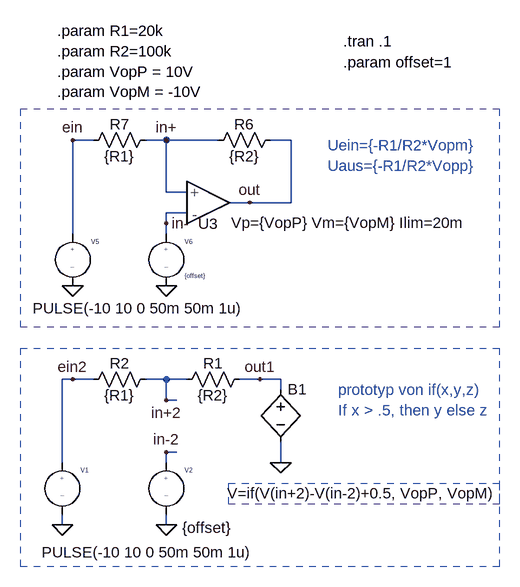
[diagram p0: schematic schmitttrigger_2.asc]
schmitttrigger_2.asc, the LTspice schematic file:
Version 4
SHEET 1 948 1976
WIRE 128 1248 96 1248
WIRE 240 1248 208 1248
WIRE 320 1248 240 1248
WIRE 432 1248 400 1248
WIRE 240 1328 240 1248
WIRE 272 1328 240 1328
WIRE 368 1344 336 1344
WIRE 432 1344 432 1248
WIRE 432 1344 368 1344
WIRE 272 1360 240 1360
WIRE 240 1376 240 1360
WIRE 96 1392 96 1248
WIRE 240 1392 240 1376
WIRE 96 1616 80 1616
WIRE 128 1616 96 1616
WIRE 240 1616 208 1616
WIRE 272 1616 240 1616
WIRE 384 1616 352 1616
WIRE 416 1616 384 1616
WIRE 416 1632 416 1616
WIRE 240 1648 240 1616
WIRE 256 1648 240 1648
WIRE 256 1728 240 1728
WIRE 80 1744 80 1616
WIRE 240 1744 240 1728
WIRE 416 1744 416 1712
WIRE 80 1840 80 1824
WIRE 240 1840 240 1824
FLAG 368 1344 out
FLAG 96 1472 0
FLAG 240 1472 0
FLAG 240 1376 in-
FLAG 96 1248 ein
FLAG 240 1248 in+
FLAG 416 1744 0
FLAG 384 1616 out1
FLAG 80 1840 0
FLAG 240 1648 in+2
FLAG 96 1616 ein2
FLAG 240 1840 0
FLAG 240 1728 in-2
SYMBOL EIT_Semiconductors\\op_3 304 1344 M180
WINDOW 123 -17 69 Invisible 2
WINDOW 3 36 -31 Left 2
SYMATTR Value2 FT=10Meg SR=1000
SYMATTR Value Vp={VopP} Vm={VopM} Ilim=20m
SYMATTR InstName U3
SYMBOL res 416 1232 R90
WINDOW 0 7 56 VBottom 2
WINDOW 3 25 56 VTop 2
SYMATTR InstName R6
SYMATTR Value {R2}
SYMBOL res 224 1232 R90
WINDOW 0 7 56 VBottom 2
WINDOW 3 25 56 VTop 2
SYMATTR InstName R7
SYMATTR Value {R1}
SYMBOL source-V 96 1376 R0
WINDOW 3 -62 131 Left 2
WINDOW 123 0 0 Left 2
WINDOW 39 0 0 Left 2
SYMATTR Value PULSE(-10 10 0 50m 50m 1u)
SYMATTR InstName V5
SYMBOL source-V 240 1376 R0
WINDOW 123 0 0 Left 2
WINDOW 39 0 0 Left 2
SYMATTR InstName V6
SYMATTR Value {offset}
SYMBOL bv 416 1616 M0
WINDOW 0 -40 15 Left 2
WINDOW 3 -332 175 Left 2
SYMATTR InstName B1
SYMATTR Value V=if(V(in+2)-V(in-2)+0.5, VopP, VopM)
SYMBOL res 368 1600 R90
WINDOW 0 7 56 VBottom 2
WINDOW 3 25 56 VTop 2
SYMATTR InstName R1
SYMATTR Value {R2}
SYMBOL res 224 1600 R90
WINDOW 0 7 56 VBottom 2
WINDOW 3 25 56 VTop 2
SYMATTR InstName R2
SYMATTR Value {R1}
SYMBOL source-V 80 1728 R0
WINDOW 3 -32 154 Left 2
WINDOW 123 0 0 Left 2
WINDOW 39 0 0 Left 2
SYMATTR Value PULSE(-10 10 0 50m 50m 1u)
SYMATTR InstName V1
SYMBOL source-V 240 1728 R0
WINDOW 123 0 0 Left 2
WINDOW 39 0 0 Left 2
WINDOW 3 24 116 Left 2
SYMATTR InstName V2
SYMATTR Value {offset}
TEXT 72 1080 Left 2 !.param R1=20k\n.param R2=100k\n.param VopP = 10V\n.param VopM = -10V
TEXT 488 1256 Left 2 ;Uein={-R1/R2*Vopm}\nUaus={-R1/R2*Vopp}
TEXT 512 1096 Left 2 !.tran .1
TEXT 512 1128 Left 2 !.param offset=1
TEXT 504 1632 Left 2 ;prototyp von if(x,y,z) \nIf x > .5, then y else z
RECTANGLE Normal 752 1536 16 1200 2
RECTANGLE Normal 752 1904 16 1568 2
RECTANGLE Normal 752 1808 336 1776 1

The netlist it stands for:
* schmitttrigger_2.asc
XU3 in+ in- out opamp_param_3 Vp={VopP} Vm={VopM} Ilim=20m FT=10Meg SR=1000 Vos=0 A0=100k phir=45 en=0 enk=0 in=0 ink=0 Rin=500Meg  ; pins In+ In- OUT
R6 out in+ {R2}
R7 in+ ein {R1}
V5 ein 0 PULSE(-10 10 0 50m 50m 1u)
V6 in- 0 {offset}
B1 out1 0 V=if(V(in+2)-V(in-2)+0.5, VopP, VopM)
R1 out1 in+2 {R2}
R2 in+2 ein2 {R1}
V1 ein2 0 PULSE(-10 10 0 50m 50m 1u)
V2 in-2 0 {offset}
.param R1=20k
.param R2=100k
.param VopP = 10V
.param VopM = -10V
* Uein={-R1/R2*Vopm}
* Uaus={-R1/R2*Vopp}
.tran .1
.param offset=1
* prototyp von if(x,y,z)
* If x > .5, then y else z
.lib EIT_sub\opamp_parametrierbar.sub
.backanno
.end